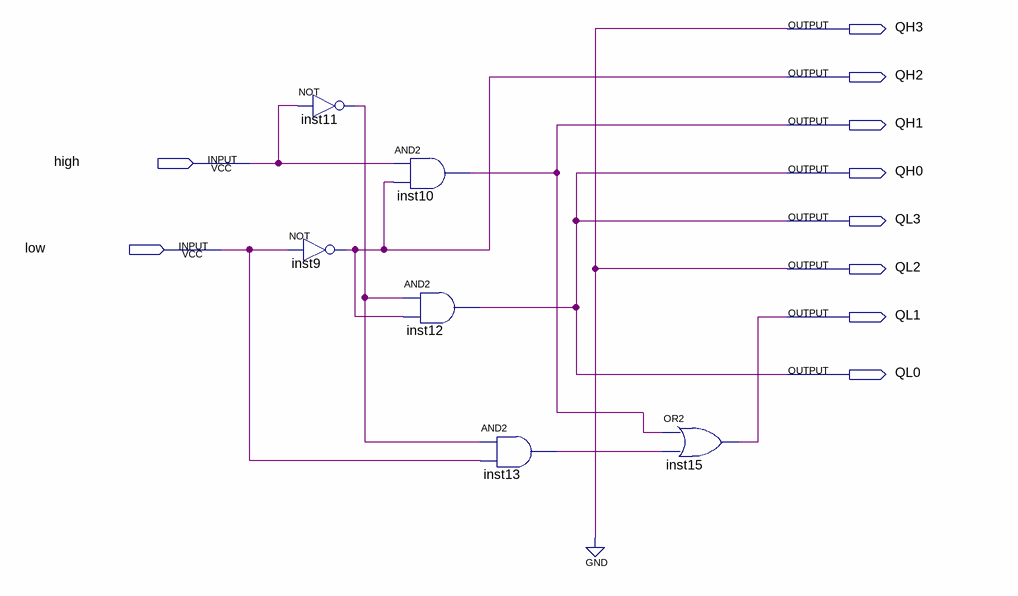
[diagram p0: schematic sheet]
// Quartus schematic trans.bdf as structural Verilog: 6 symbols, 10 pins
module trans (
  input  high,
  input  low,
  output QH3,
  output QH2,
  output QH1,
  output QH0,
  output QL3,
  output QL2,
  output QL1,
  output QL0
);

  wire inst11_out, inst13_out;

  not inst11 (inst11_out, high);
  not inst9 (QH2, low);
  and inst10 (QH1, high, QH2);
  and inst12 (QH0, inst11_out, QH2);
  and inst13 (inst13_out, inst11_out, low);
  or inst15 (QL1, QH1, inst13_out);

  assign QH3 = 1'b0;
  assign QL0 = QH0;
  assign QL2 = 1'b0;
  assign QL3 = QH0;
endmodule
